# Altium project Velvet_v1.1-2021(revised for PCB).PrjPcb
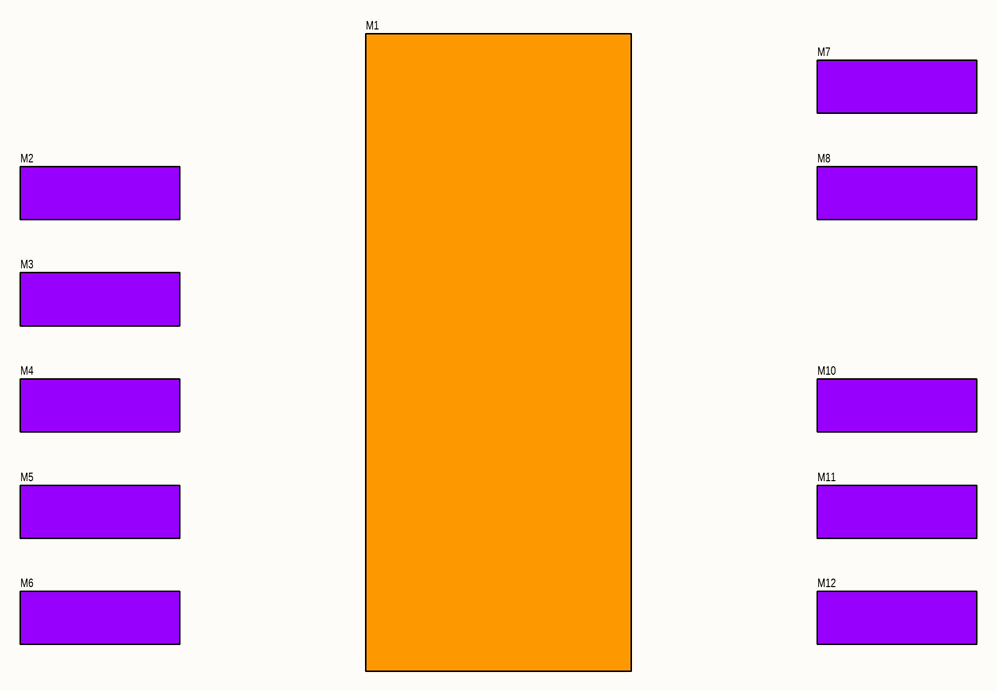
[diagram p0: Схема структурная Velvet_V1.1-2021.SchDoc]
10 sheets, 117 parts. Net scope: flat (ports and power ports of the same name join across sheets).
Sheets:
  Схема структурная Velvet_V1.1-2021.SchDoc
  Схема блока МК.SchDoc
  Схема блока GSM.SchDoc
  Схема блока WiFi.SchDoc
  Схема блока USB-UART.SchDoc
  Схема блока Sensors.SchDoc
  Схема блока IO_Ports.SchDoc
  Схема блока SD.SchDoc
  Схема блока LoRa_RAK3172.SchDoc
  Схема блока MOSFET.SchDoc

## Sheet Схема структурная Velvet_V1.1-2021.SchDoc
size 420 x 297 mm; Address1: Address1; Address2: Address2; Address3: Address3; Address4: Address4; DocumentNumber: АБВГ.123456.001 Э3; SheetNumber: 1; Scale: 1:1; DocumentType: Схема электрическая принципиальная; FirstReferrence: АБВГ.123456.001

### Sub-sheets
M1 = File Name (file not in this document): no entries
M2 = File Name (file not in this document): no entries
M3 = File Name (file not in this document): no entries
M4 = File Name (file not in this document): no entries
M5 = File Name (file not in this document): no entries
M6 = File Name (file not in this document): no entries
M7 = File Name (file not in this document): no entries
M8 = File Name (file not in this document): no entries
M10 = File Name (file not in this document): no entries
M11 = File Name (file not in this document): no entries
M12 = File Name (file not in this document): no entries

### Notes on the sheet
- Перв. примен.
- Справ. №
- Подп. и дата
- Инв. № дубл.
- Взам. инв. №
- Разраб.
- Изм.
- Лист
- № докум.
- Подп.
- Дата
- Лит.
- Масса
- Масштаб
- Пров.
- Т.контр.
- Листов
- Инв. № подл.
- Утв.
- Н.контр.
- 2.106-A3
- Копировал
- Формат А3

## Sheet Схема блока МК.SchDoc
size 420 x 297 mm; Address1: Address1; Address2: Address2; Address3: Address3; Address4: Address4; DocumentNumber: АБВГ.123456.001 Э3; SheetNumber: 1; Scale: 1:1; DocumentType: Схема электрическая принципиальная; FirstReferrence: АБВГ.123456.001
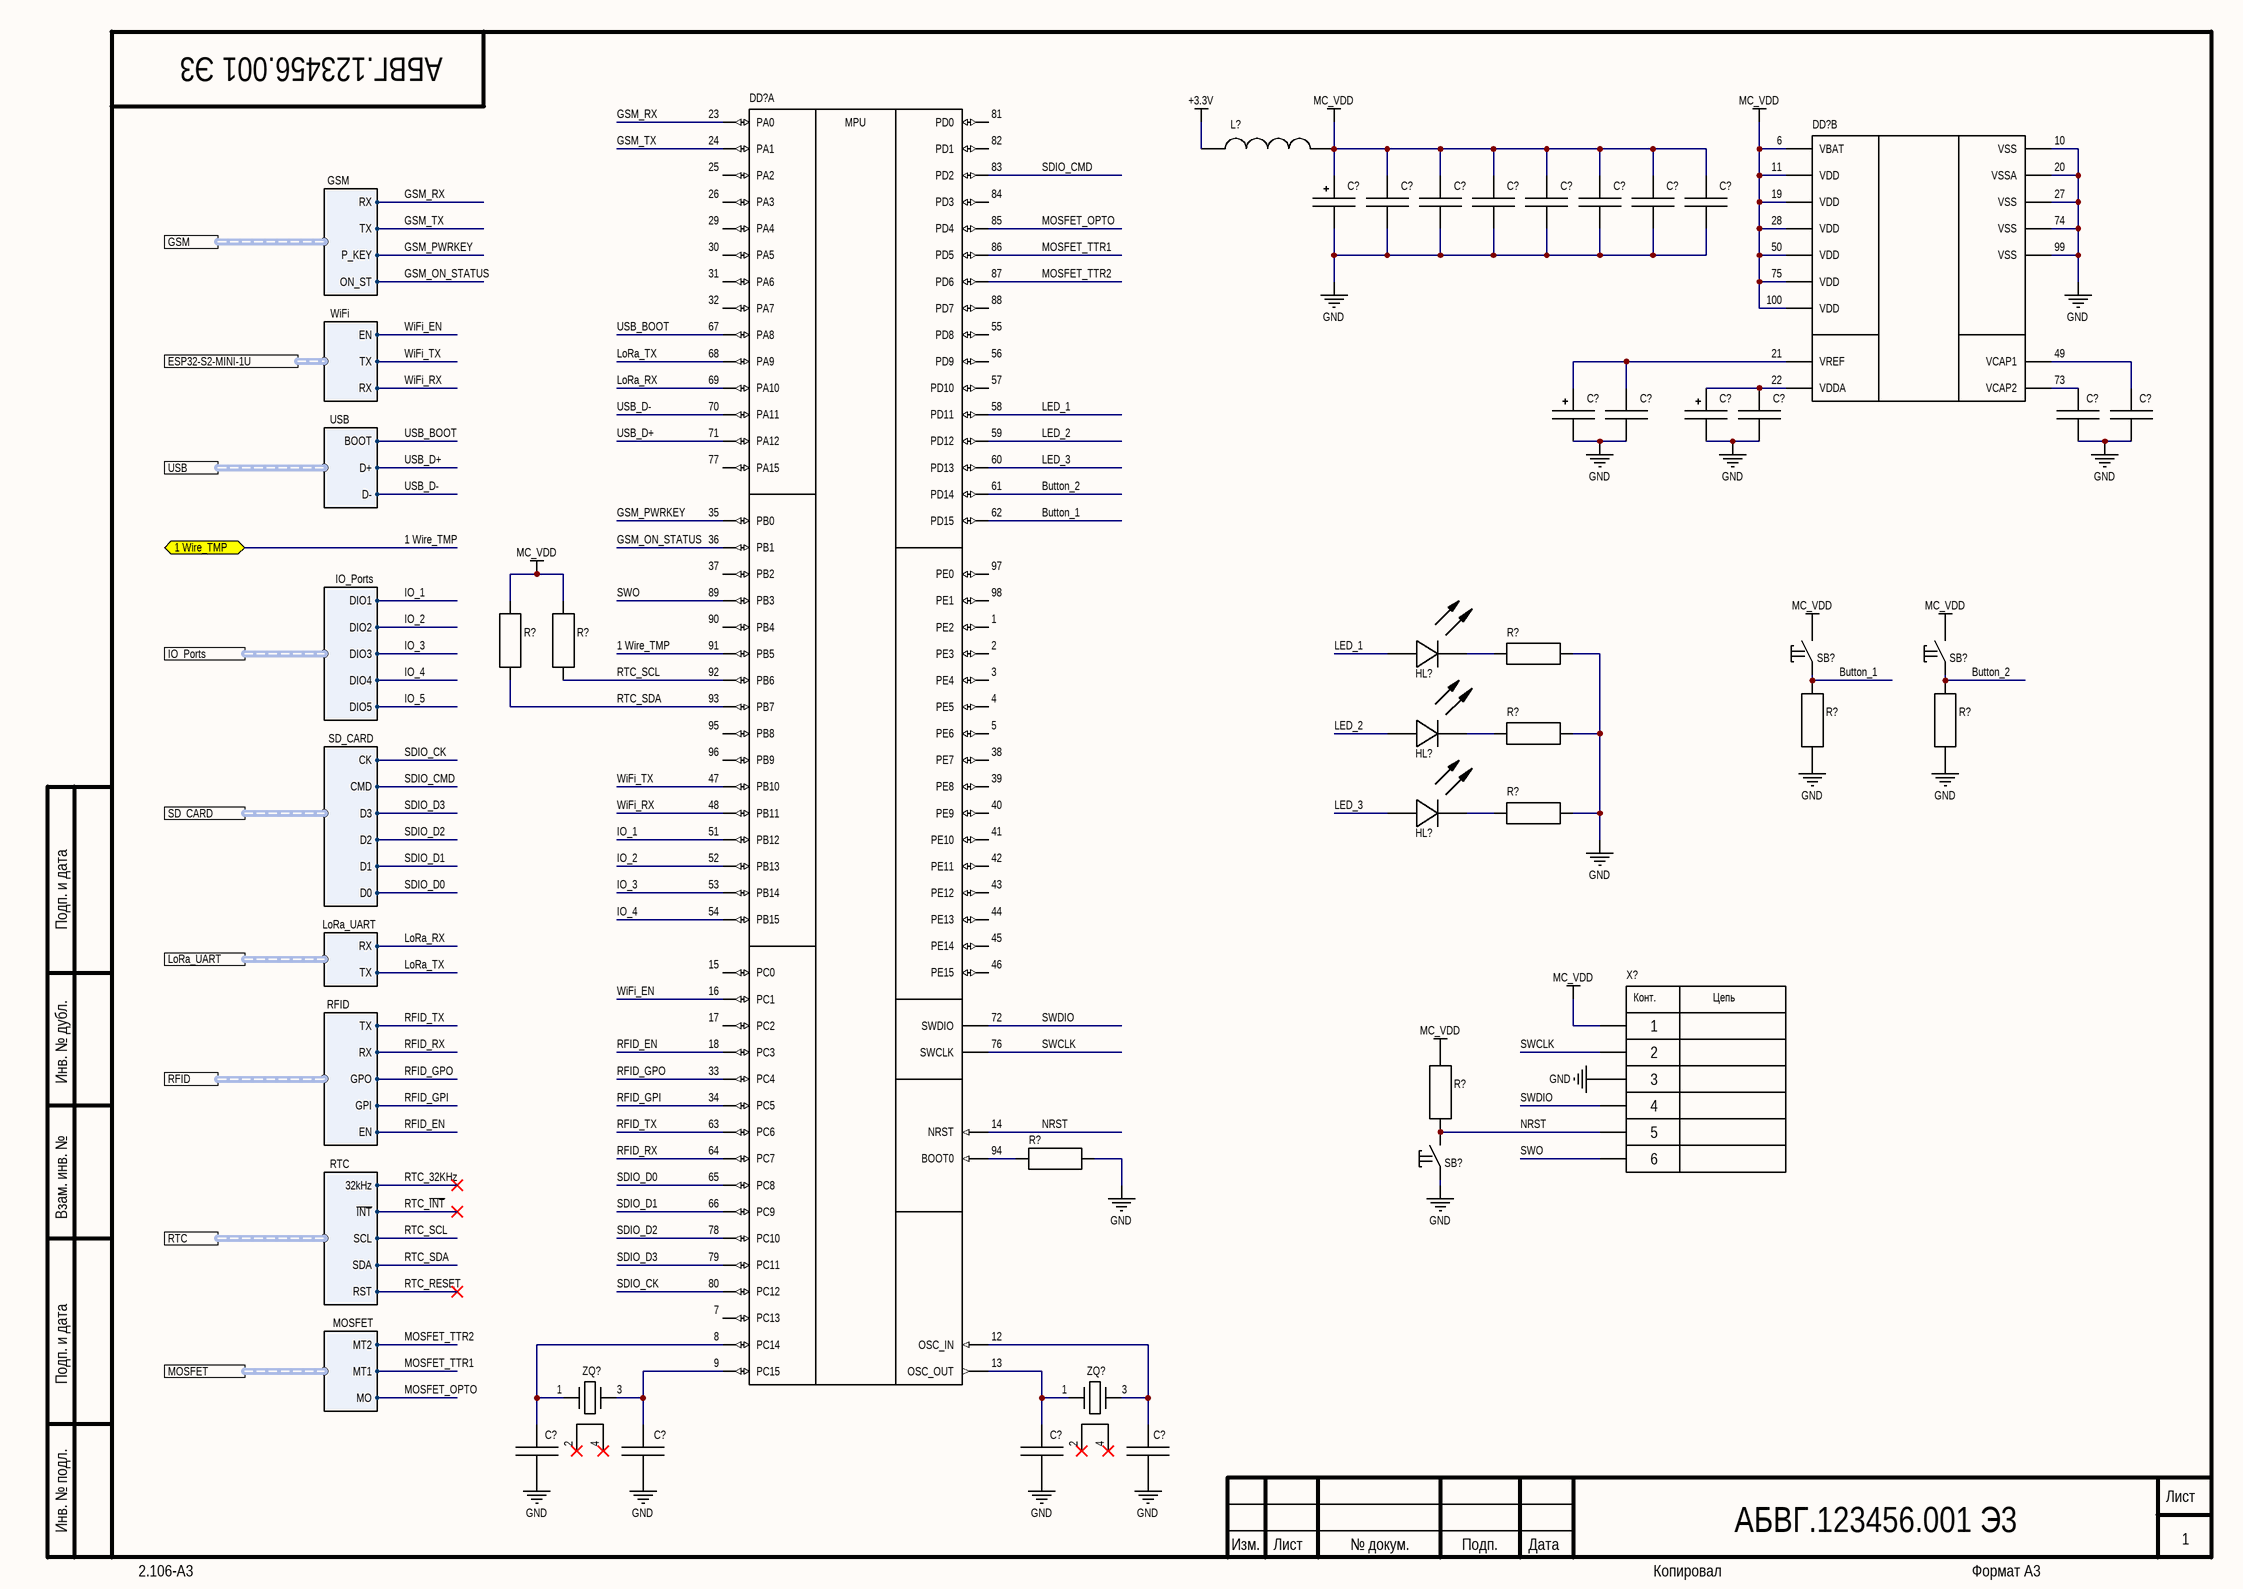
[diagram p1: Схема блока МК.SchDoc]

### Parts
(Parts that share a designator on the sheet are numbered #1, #2 ... from top to bottom, then left to right.)
C?#1  *  [TANTAL_A]  (value not drawn)
C?#2  *  [CH0603C]  (value not drawn)
C?#3  *  [CH0603C]  (value not drawn)
C?#4  *  [CH0603C]  (value not drawn)
C?#5  *  [CH0603C]  (value not drawn)
C?#6  *  [CH0603C]  (value not drawn)
C?#7  *  [CH0603C]  (value not drawn)
C?#8  *  [CH0603C]  (value not drawn)
C?#9  *  [TANTAL_A]  (value not drawn)
C?#10  *  [CH0603C]  (value not drawn)
C?#11  *  [TANTAL_A]  (value not drawn)
C?#12  *  [CH0603C]  (value not drawn)
C?#13  *  [CH0603C]  (value not drawn)
C?#14  *  [CH0603C]  (value not drawn)
C?#15  *  [CH0603C]  (value not drawn)
C?#16  *  [CH0603C]  (value not drawn)
C?#17  *  [CH0603C]  (value not drawn)
C?#18  *  [CH0603C]  (value not drawn)
DD?#1  STM32F407VGT6  [100-LQFP]  (value not drawn)  (part A of 2)
DD?#2  STM32F407VGT6  [100-LQFP]  (value not drawn)  (part B of 2)
HL?#1  *  [CH0805LG]  (value not drawn)
HL?#2  *  [CH0805LG]  (value not drawn)
HL?#3  *  [CH0805LG]  (value not drawn)
L?  *  [CH0603L]  (value not drawn)
R?#1  *  [CH0603R - without silc]  (value not drawn)
R?#2  *  [CH0603R]  (value not drawn)
R?#3  *  [CH0603R]  (value not drawn)
R?#4  *  [CH0603R - without silc]  (value not drawn)
R?#5  *  [CH0603R]  (value not drawn)
R?#6  *  [CH0603R]  (value not drawn)
R?#7  *  [CH0603R - without silc]  (value not drawn)
R?#8  *  [CH0603R]  (value not drawn)
R?#9  *  [CH0603R]  (value not drawn)
SB?#1  Tactile switches  [BUT: 6x6]  (value not drawn)
SB?#2  Tactile switches  [BUT: 6x6]  (value not drawn)
SB?#3  Tactile switches  [BUT: 6x6]  (value not drawn)
X?#1  *  [CON: PLS-6]  (value not drawn)
ZQ?#1  *  [OSC: 3215]  (value not drawn)
ZQ?#2  *  [OSC: ABM3]  (value not drawn)

### Ports
1 Wire_TMP (bidir), ESP32-S2-MINI-1U (harness WiFi), GSM (harness GSM), IO_Ports (harness IO_Ports), LoRa_UART (harness LoRa_UART), MOSFET (harness MOSFET), RFID (harness RFID), RTC (harness RTC), SD_CARD (harness SD_CARD), USB (harness USB)

### Harnesses
GSM: RX, TX, P_KEY, ON_ST
WiFi: EN, TX, RX
USB: BOOT, D+, D-
IO_Ports: DIO1, DIO2, DIO3, DIO4, DIO5
SD_CARD: CK, CMD, D3, D2, D1, D0
LoRa_UART: RX, TX
RFID: TX, RX, GPO, GPI, EN
RTC: 32kHz, ~{INT}, SCL, SDA, RST
MOSFET: MT2, MT1, MO

### Nets
+3.3V: L?.2
GND: C?#1.2 C?#2.2 C?#3.2 C?#4.2 C?#5.2 C?#6.2 C?#7.2 C?#8.2 C?#9.2 C?#10.2 C?#11.2 C?#12.2 C?#13.2 C?#14.2 C?#15.2 C?#16.2 C?#17.2 C?#18.2 DD?#2.10(VSS) DD?#2.20(VSSA) DD?#2.27(VSS) DD?#2.74(VSS) DD?#2.99(VSS) R?#1.2 R?#4.2 R?#5.1 R?#6.1 R?#7.2 R?#9.1 SB?#3.1 X?#1.3
MC_VDD: C?#1.1 C?#2.1 C?#3.1 C?#4.1 C?#5.1 C?#6.1 C?#7.1 C?#8.1 DD?#2.6(VBAT) DD?#2.11(VDD) DD?#2.19(VDD) DD?#2.28(VDD) DD?#2.50(VDD) DD?#2.75(VDD) DD?#2.100(VDD) L?.1 R?#2.2 R?#3.2 R?#8.2 SB?#1.2 SB?#2.2 X?#1.1
1 Wire_TMP: DD?#1.91(PB5) ; port 1 Wire_TMP
Button_1: DD?#1.62(PD15) R?#5.2 SB?#1.1
Button_2: DD?#1.61(PD14) R?#6.2 SB?#2.1
GSM_ON_STATUS: DD?#1.36(PB1) ; port GSM.ON_ST
GSM_PWRKEY: DD?#1.35(PB0) ; port GSM.P_KEY
GSM_RX: DD?#1.23(PA0) ; port GSM.RX
GSM_TX: DD?#1.24(PA1) ; port GSM.TX
IO_1: DD?#1.51(PB12) ; port IO_Ports.DIO1
IO_2: DD?#1.52(PB13) ; port IO_Ports.DIO2
IO_3: DD?#1.53(PB14) ; port IO_Ports.DIO3
IO_4: DD?#1.54(PB15) ; port IO_Ports.DIO4
LED_1: DD?#1.58(PD11) HL?#1.1(A)
LED_2: DD?#1.59(PD12) HL?#2.1(A)
LED_3: DD?#1.60(PD13) HL?#3.1(A)
LoRa_RX: DD?#1.69(PA10) ; port LoRa_UART.RX
LoRa_TX: DD?#1.68(PA9) ; port LoRa_UART.TX
MOSFET_OPTO: DD?#1.85(PD4) ; port MOSFET.MO
MOSFET_TTR1: DD?#1.86(PD5) ; port MOSFET.MT1
MOSFET_TTR2: DD?#1.87(PD6) ; port MOSFET.MT2
NRST: DD?#1.14(NRST) R?#8.1 SB?#3.2 X?#1.5
RFID_EN: DD?#1.18(PC3) ; port RFID.EN
RFID_GPI: DD?#1.34(PC5) ; port RFID.GPI
RFID_GPO: DD?#1.33(PC4) ; port RFID.GPO
RFID_RX: DD?#1.64(PC7) ; port RFID.RX
RFID_TX: DD?#1.63(PC6) ; port RFID.TX
RTC_32KHz: port RTC.32kHz
RTC_~{INT}: port RTC.~{INT}
RTC_RESET: port RTC.RST
RTC_SCL: DD?#1.92(PB6) R?#3.1 ; port RTC.SCL
RTC_SDA: DD?#1.93(PB7) R?#2.1 ; port RTC.SDA
SDIO_CK: DD?#1.80(PC12) ; port SD_CARD.CK
SDIO_CMD: DD?#1.83(PD2) ; port SD_CARD.CMD
SDIO_D0: DD?#1.65(PC8) ; port SD_CARD.D0
SDIO_D1: DD?#1.66(PC9) ; port SD_CARD.D1
SDIO_D2: DD?#1.78(PC10) ; port SD_CARD.D2
SDIO_D3: DD?#1.79(PC11) ; port SD_CARD.D3
SWCLK: DD?#1.76(SWCLK) X?#1.2
SWDIO: DD?#1.72(SWDIO) X?#1.4
SWO: DD?#1.89(PB3) X?#1.6
USB_BOOT: DD?#1.67(PA8) ; port USB.BOOT
USB_D+: DD?#1.71(PA12) ; port USB.D+
USB_D-: DD?#1.70(PA11) ; port USB.D-
WiFi_EN: DD?#1.16(PC1) ; port ESP32-S2-MINI-1U.EN
WiFi_RX: DD?#1.48(PB11) ; port ESP32-S2-MINI-1U.RX
WiFi_TX: DD?#1.47(PB10) ; port ESP32-S2-MINI-1U.TX
NetC?#9_1: C?#9.1 C?#10.1 DD?#2.21(VREF)
NetC?#11_1: C?#11.1 C?#12.1 DD?#2.22(VDDA)
NetC?#13_1: C?#13.1 DD?#2.73(VCAP2)
NetC?#14_1: C?#14.1 DD?#2.49(VCAP1)
NetC?#15_1: C?#15.1 DD?#1.8(PC14) ZQ?#1.1
NetC?#16_1: C?#16.1 DD?#1.9(PC15) ZQ?#1.3
NetC?#17_1: C?#17.1 DD?#1.13(OSC_OUT) ZQ?#2.1
NetC?#18_1: C?#18.1 DD?#1.12(OSC_IN) ZQ?#2.3
NetDD?#1_94: DD?#1.94(BOOT0) R?#9.2
NetHL?#1_2: HL?#1.2(C) R?#1.1
NetHL?#2_2: HL?#2.2(C) R?#4.1
NetHL?#3_2: HL?#3.2(C) R?#7.1

Not connected (* = marked no-connect by the designer): DD?#1 1(PE2) 2(PE3) 3(PE4) 4(PE5) 5(PE6) 7(PC13) 15(PC0) 17(PC2) 25(PA2) 26(PA3) 29(PA4) 30(PA5) 31(PA6) 32(PA7) 37(PB2) 38(PE7) 39(PE8) 40(PE9) 41(PE10) 42(PE11) 43(PE12) 44(PE13) 45(PE14) 46(PE15) 55(PD8) 56(PD9) 57(PD10) 77(PA15) 81(PD0) 82(PD1) 84(PD3) 88(PD7) 90(PB4) 95(PB8) 96(PB9) 97(PE0) 98(PE1); ZQ?#1 2* 4*; ZQ?#2 2* 4*

### Notes on the sheet
- Подп. и дата
- Инв. № дубл.
- Взам. инв. №
- Инв. № подл.
- Изм.
- Лист
- № докум.
- Подп.
- Дата
- 2.106-A3
- Копировал
- Формат А3
- (in symbol 6-Connector) Конт.; Цепь
- (in symbol STM32F407VGT6, part A) MPU

### Library data of the parts
C?#1 C?#9 C?#11 = TantalCap: Manufacturer: *; Model: *; HelpURL: *; ComponentKind: *; Value: *
C?#2-C?#8 C?#10 C?#12-C?#18 = Capacitor: Manufacturer: *; Model: *; HelpURL: *; ComponentKind: *; Value: *
DD?#1 = STM32F407VGT6: Cortex-M4; Manufacturer: STMicroelectronics; Model: STM32F407VGT6; HelpURL: https://www.digikey.com/en/products/detail/stmicroelectronics/STM32F407VGT6/2747117; ComponentKind: 100-LQFP; Supplier 1: Digi-Key; Supplier Part Number 1: 497-11605-ND
DD?#2 = STM32F407VGT6: Cortex-M4; Manufacturer: STMicroelectronics; Model: STM32F407VET6; HelpURL: https://www.digikey.com/product-detail/en/stmicroelectronics/STM32F407VET6/497-12075-ND/2793093; ComponentKind: 100-LQFP
HL?#1-HL?#3 = LED: Manufacturer: *; Model: *; HelpURL: *; ComponentKind: *; Value: *
L? = Inductor: Manufacturer: *; Model: *; HelpURL: https://www.digikey.com/en/products/detail/murata-electronics/BLM18AG102SN1D/584226?s=N4IgTCBcDaIEIBkCyBGAHAQQOIoAxgGUA5FAERAF0BfIA; ComponentKind: *; Value: *; Supplier 1: RSComponents; Supplier Part Number 1: 2303783
R?#1-R?#9 = Resistor: Manufacturer: *; Model: *; HelpURL: *; ComponentKind: *; Value: *
SB?#1-SB?#3 = Tactile switches: 6x6 mm; Manufacturer: *; Model: *; HelpURL: *; ComponentKind: *
X?#1 = 6-Connector: Model: *; Manufacturer: *; HelpURL: *; ComponentKind: *
ZQ?#1 ZQ?#2 = Oscillator: Manufacturer: *; Model: *; HelpURL: *; ComponentKind: *; Value: *

## Sheet Схема блока GSM.SchDoc
size 420 x 297 mm; Address1: Address1; Address2: Address2; Address3: Address3; Address4: Address4; DocumentNumber: АБВГ.123456.001 Э3; SheetNumber: 1; Scale: 1:1; DocumentType: Схема электрическая принципиальная; FirstReferrence: АБВГ.123456.001
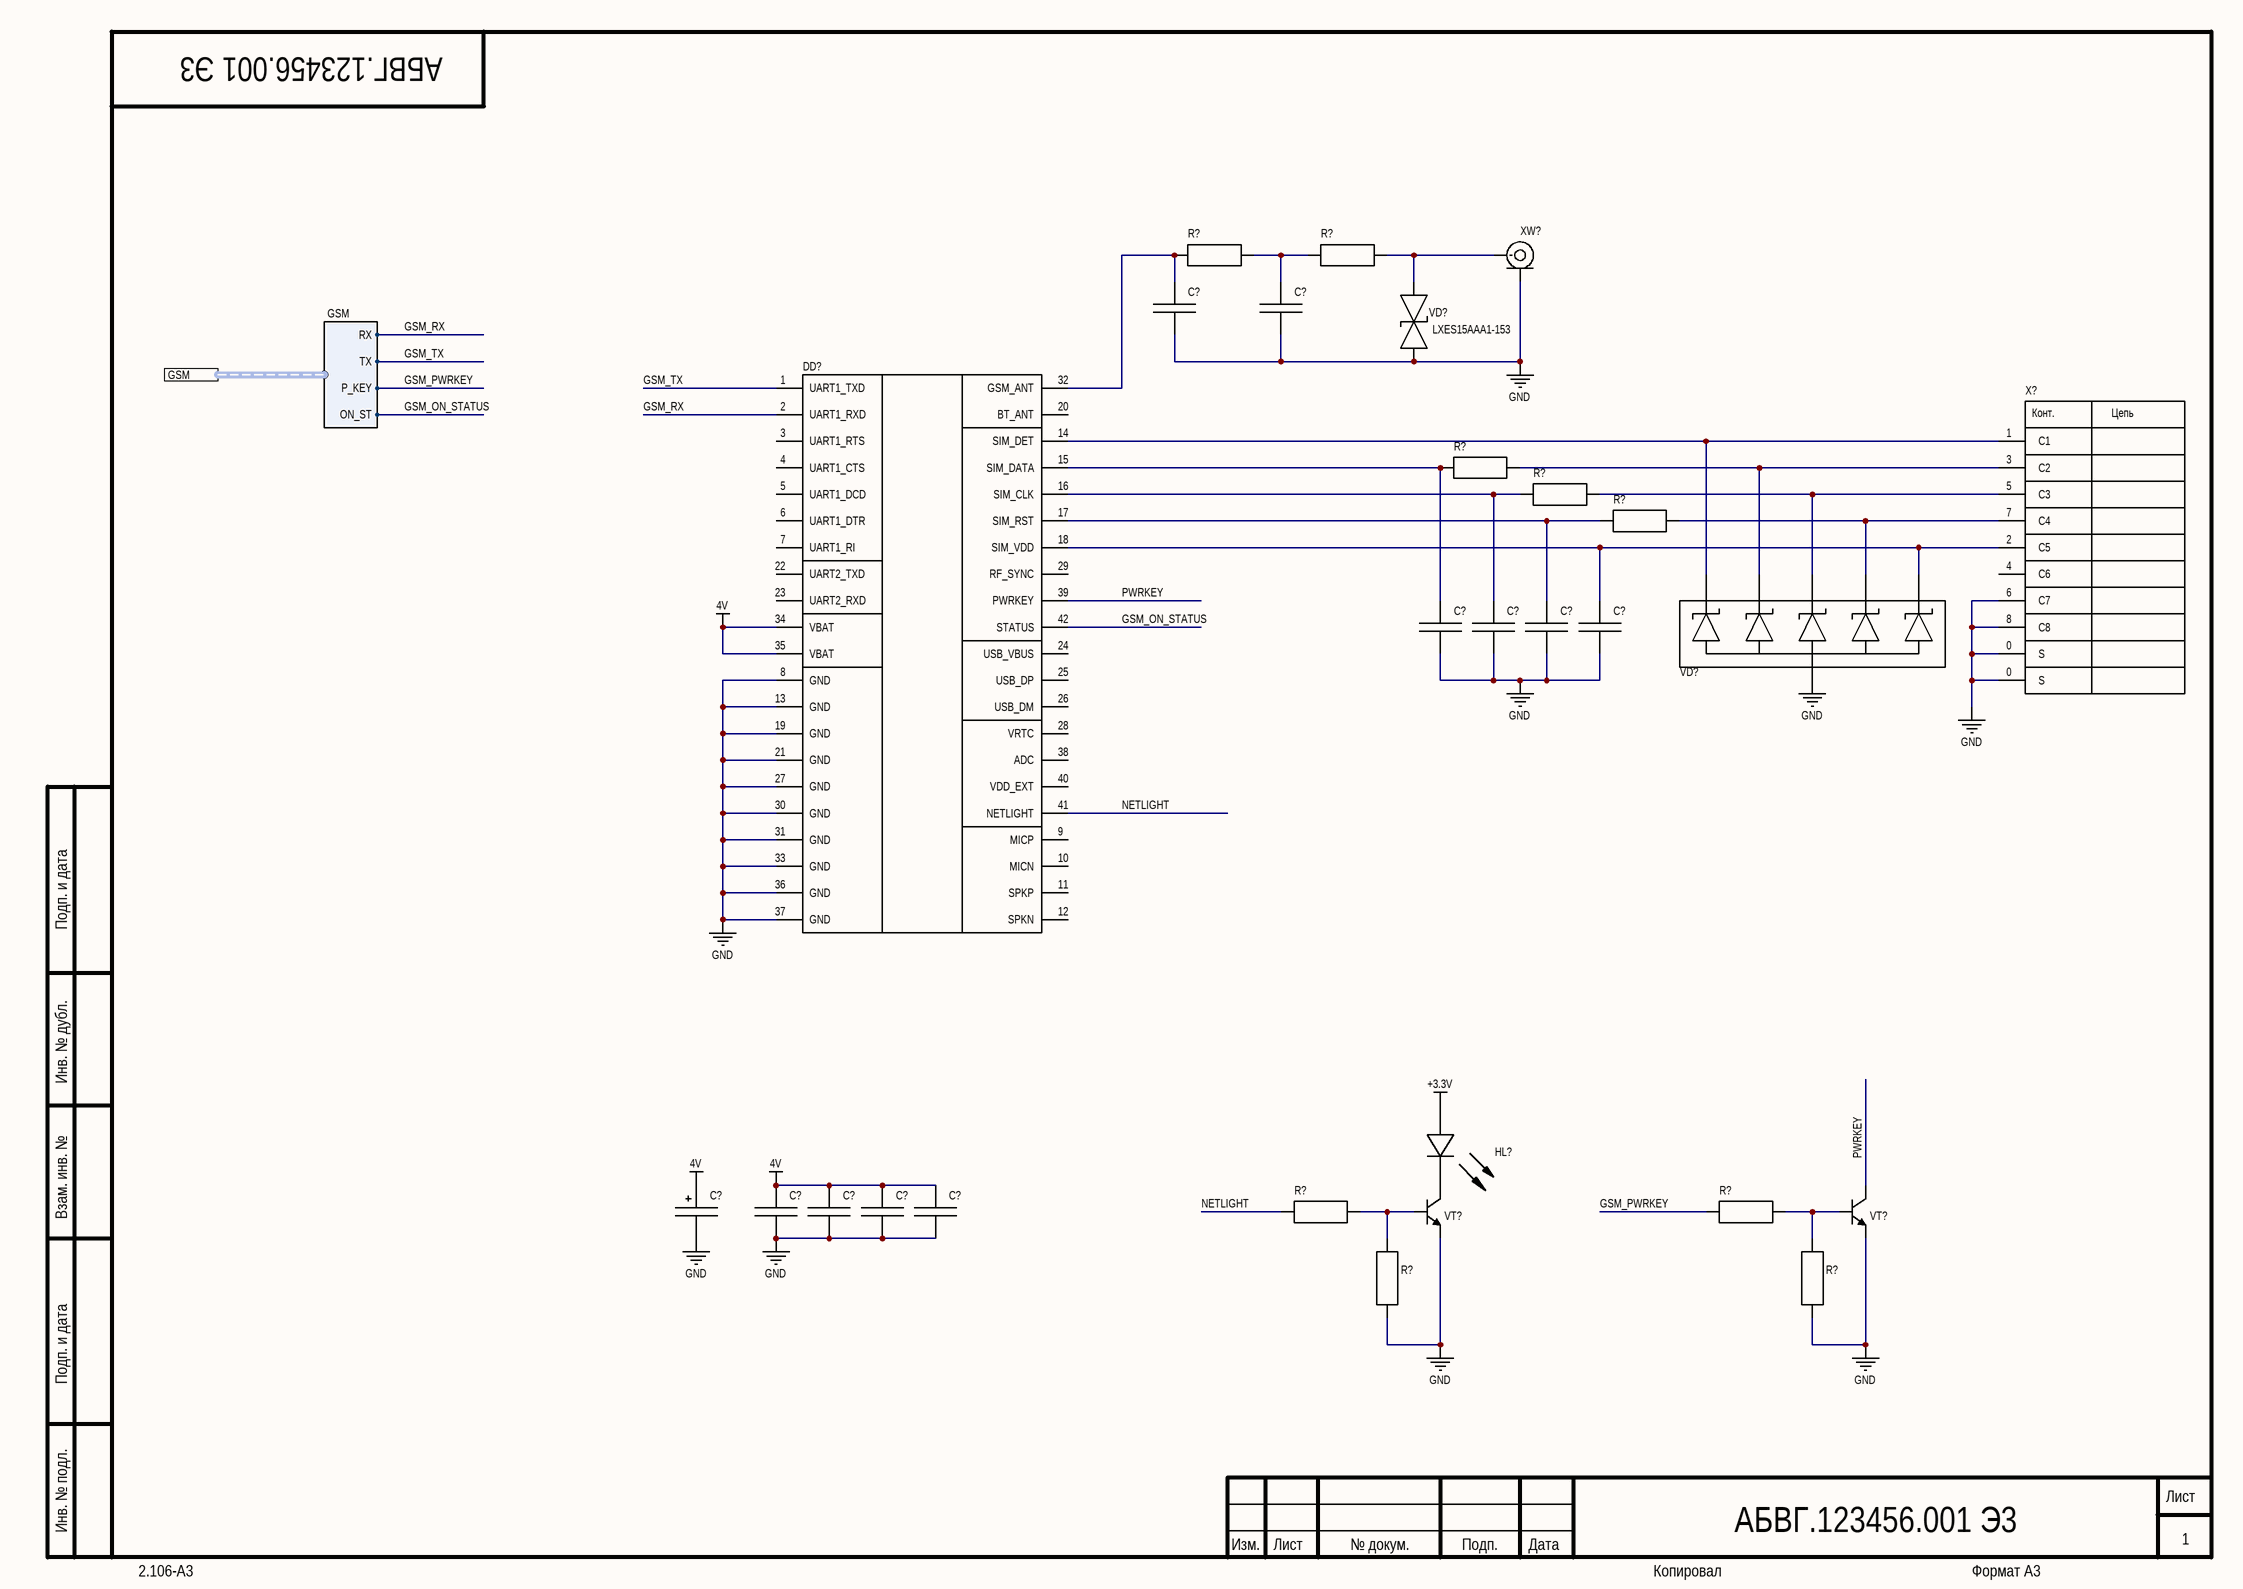
[diagram p2: Схема блока GSM.SchDoc]

### Parts
(Parts that share a designator on the sheet are numbered #1, #2 ... from top to bottom, then left to right.)
C?#19  *  [CH0603C]  (value not drawn)
C?#20  *  [CH0603C]  (value not drawn)
C?#21  *  [CH0603C]  (value not drawn)
C?#22  *  [CH0603C]  (value not drawn)
C?#23  *  [CH0603C]  (value not drawn)
C?#24  *  [CH0603C]  (value not drawn)
C?#25  *  [TANTAL_A]  (value not drawn)
C?#26  *  [CH0603C]  (value not drawn)
C?#27  *  [CH0603C]  (value not drawn)
C?#28  *  [CH0603C]  (value not drawn)
C?#29  *  [CH0603C]  (value not drawn)
DD?#3  SIM800С  [MOD: SIM800C]  (value not drawn)
HL?#4  2.1V GREEN  [CH0805LG]  (value not drawn)
R?#10  *  [CH0603R - without silc]  (value not drawn)
R?#11  *  [CH0603R - without silc]  (value not drawn)
R?#12  *  [CH0603R - without silc]  (value not drawn)
R?#13  *  [CH0603R - without silc]  (value not drawn)
R?#14  *  [CH0603R - without silc]  (value not drawn)
R?#15  *  [CH0603R - without silc]  (value not drawn)
R?#16  *  [CH0603R - without silc]  (value not drawn)
R?#17  *  [CH0603R - without silc]  (value not drawn)
R?#18  *  [CH0603R - without silc]  (value not drawn)
VD?#1  LXES15AAA1-153  [CH0402L]
VD?#2  SMF05CT1G  [SOT-363]  (value not drawn)
VT?#1  *  [8-HSOF]  (value not drawn)
VT?#2  *  [8-HSOF]  (value not drawn)
X?#2  *  [CON: MicroSIM 8P SMD]  (value not drawn)
XW?  SMA  [CON: SMA]  (value not drawn)

### Ports
GSM (harness GSM)

### Harnesses
GSM: RX, TX, P_KEY, ON_ST

### Nets
4V: C?#25.1 C?#26.1 C?#27.1 C?#28.1 C?#29.1 DD?#3.34(VBAT) DD?#3.35(VBAT)
+3.3V: HL?#4.1(A)
GND: C?#19.2 C?#20.2 C?#21.2 C?#22.2 C?#23.2 C?#24.2 C?#25.2 C?#26.2 C?#27.2 C?#28.2 C?#29.2 DD?#3.8(GND) DD?#3.13(GND) DD?#3.19(GND) DD?#3.21(GND) DD?#3.27(GND) DD?#3.30(GND) DD?#3.31(GND) DD?#3.33(GND) DD?#3.36(GND) DD?#3.37(GND) R?#17.1 R?#18.1 VD?#1.1(A) VD?#2.2 VT?#1.3(E) VT?#2.3(E) X?#2.0(S) X?#2.6(C7) X?#2.8(C8) XW?.2(IN)
GSM_ON_STATUS: DD?#3.42(STATUS) ; port GSM.ON_ST
GSM_PWRKEY: R?#16.1 ; port GSM.P_KEY
GSM_RX: DD?#3.2(UART1_RXD) ; port GSM.RX
GSM_TX: DD?#3.1(UART1_TXD) ; port GSM.TX
NETLIGHT: DD?#3.41(NETLIGHT) R?#15.1
PWRKEY: DD?#3.39(PWRKEY) VT?#2.2(C)
NetC?#19_1: C?#19.1 DD?#3.32(GSM_ANT) R?#10.1
NetC?#20_1: C?#20.1 R?#10.2 R?#11.1
NetC?#21_1: C?#21.1 DD?#3.15(SIM_DATA) R?#12.1
NetC?#22_1: C?#22.1 DD?#3.16(SIM_CLK) R?#13.1
NetC?#23_1: C?#23.1 DD?#3.17(SIM_RST) R?#14.1
NetC?#24_1: C?#24.1 DD?#3.18(SIM_VDD) VD?#2.6 X?#2.2(C5)
NetDD?#3_14: DD?#3.14(SIM_DET) VD?#2.1 X?#2.1(C1)
NetHL?#4_2: HL?#4.2(C) VT?#1.2(C)
NetR?#11_2: R?#11.2 VD?#1.2(C) XW?.1(IN)
NetR?#12_2: R?#12.2 VD?#2.3 X?#2.3(C2)
NetR?#13_2: R?#13.2 VD?#2.4 X?#2.5(C3)
NetR?#14_2: R?#14.2 VD?#2.5 X?#2.7(C4)
NetR?#15_2: R?#15.2 R?#17.2 VT?#1.1(B)
NetR?#16_2: R?#16.2 R?#18.2 VT?#2.1(B)

Not connected (* = marked no-connect by the designer): DD?#3 3(UART1_RTS) 4(UART1_CTS) 5(UART1_DCD) 6(UART1_DTR) 7(UART1_RI) 9(MICP) 10(MICN) 11(SPKP) 12(SPKN) 20(BT_ANT) 22(UART2_TXD) 23(UART2_RXD) 24(USB_VBUS) 25(USB_DP) 26(USB_DM) 28(VRTC) 29(RF_SYNC) 38(ADC) 40(VDD_EXT); X?#2 4(C6)

### Notes on the sheet
- Подп. и дата
- Инв. № дубл.
- Взам. инв. №
- Инв. № подл.
- Изм.
- Лист
- № докум.
- Подп.
- Дата
- 2.106-A3
- Копировал
- Формат А3
- (in symbol 10-Connector) Конт.; Цепь

### Library data of the parts
C?#19-C?#24 C?#26-C?#29 = Capacitor: Manufacturer: *; Model: *; HelpURL: *; ComponentKind: *; Value: *
C?#25 = TantalCap: Manufacturer: *; Model: *; HelpURL: *; ComponentKind: *; Value: *
DD?#3 = SIM800С: GSM; Manufacturer: SIMCom Wireless Solutions; Model: SIM800C; ComponentKind: SMD; HelpURL: http://mt-system.ru/SIMCom/SIM800C
HL?#4 = LED: Manufacturer: Lite-On Inc.; Model: LTST-S220GKT; HelpURL: https://www.digikey.com/en/products/detail/LTST-S220GKT/160-1218-1-ND/337134?utm_campaign=buynow&utm_medium=aggregator&curr=usd&utm_source=octopart; ComponentKind: 0805 (2012 Metric); Value: 2.1V GREEN
R?#10-R?#18 = Resistor: Manufacturer: *; Model: *; HelpURL: *; ComponentKind: *; Value: *
VD?#1 = Diod TVS: Manufacturer: Murata Electronics; ComponentKind: Surface Mount 1005; Model: LXES15AAA1-153; HelpURL: https://www.digikey.com/en/products/detail/murata-electronics/LXES15AAA1-153/5843762?s=N4IgTCBcDaIDIA0CiBlAjAVgII7QWkwGYQBdAXyA
VD?#2 = Diod Schottky Array: Manufacturer: onsemi; ComponentKind: 12.5V Clamp 8A (8/20µs) Ipp Tvs Diode Surface Mount SC-88/SC70-6/SOT-363; Model: SMF05CT1G; HelpURL: https://www.digikey.com/en/products/detail/onsemi/SMF05CT1G/921631?s=N4IgTCBcDaIMoFkBiAGArAYQCoEYDiIAugL5A
VT?#1 VT?#2 = Transistor NPN: Bipolar; Model: *; Manufacturer: *; ComponentKind: *; HelpURL: *
X?#2 = 10-Connector: MicroSIM; Model: *; Manufacturer: *; HelpURL: *; ComponentKind: *
XW? = SMA: RF; Model: *; Manufacturer: *; HelpURL: *; ComponentKind: *

## Sheet Схема блока WiFi.SchDoc
size 420 x 297 mm; Address1: Address1; Address2: Address2; Address3: Address3; Address4: Address4; DocumentNumber: АБВГ.123456.001 Э3; SheetNumber: 1; Scale: 1:1; DocumentType: Схема электрическая принципиальная; FirstReferrence: АБВГ.123456.001
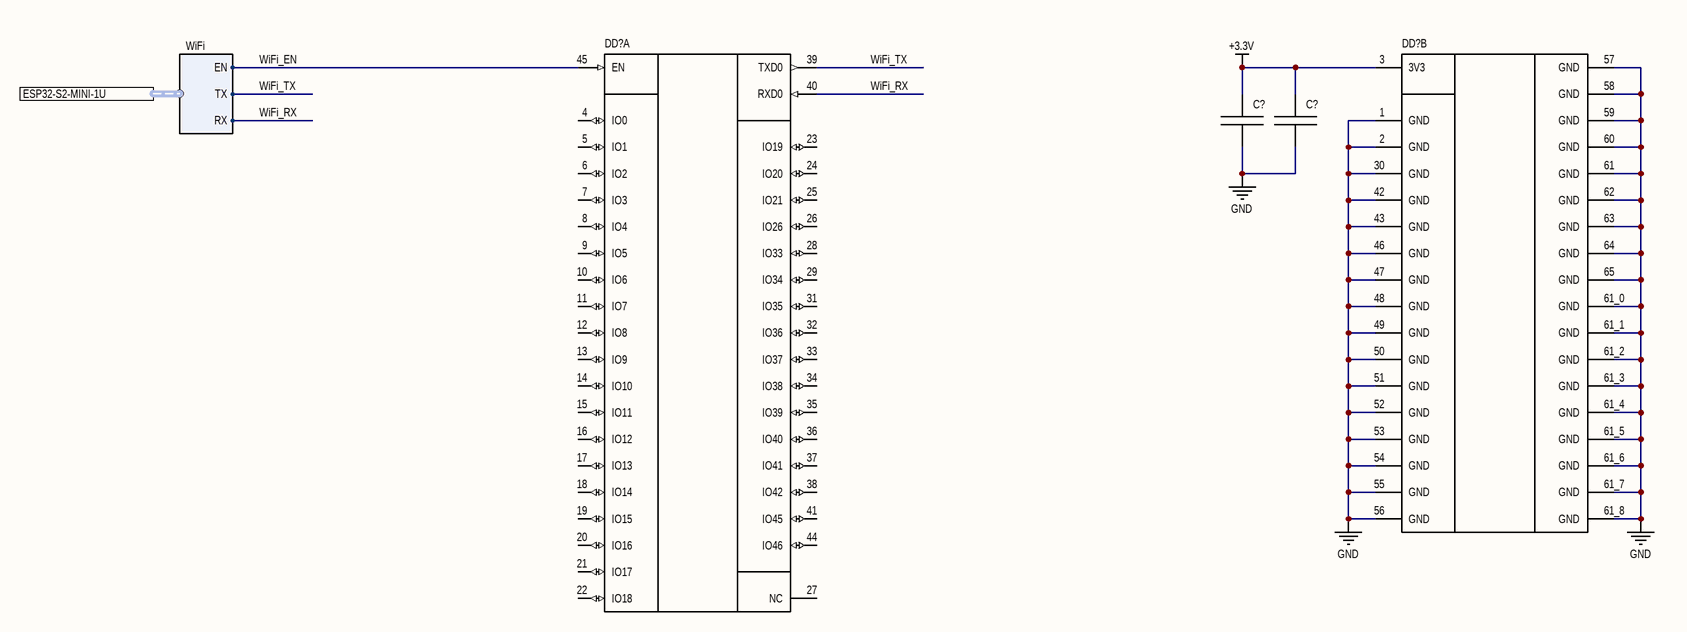
[diagram p3: Схема блока WiFi.SchDoc]

### Parts
(Parts that share a designator on the sheet are numbered #1, #2 ... from top to bottom, then left to right.)
C?#30  *  [CH0805C]  (value not drawn)
C?#31  *  [CH0805C]  (value not drawn)
DD?#4  ESP32­S2­MINI­1U  [MOD: ESP32-S2-MINI-1U]  (value not drawn)  (part A of 2)
DD?#5  ESP32­S2­MINI­1U  [MOD: ESP32-S2-MINI-1U]  (value not drawn)  (part B of 2)

### Ports
ESP32-S2-MINI-1U (harness WiFi)

### Harnesses
WiFi: EN, TX, RX

### Nets
+3.3V: C?#30.1 C?#31.1 DD?#5.3(3V3)
GND: C?#30.2 C?#31.2 DD?#5.1(GND) DD?#5.2(GND) DD?#5.30(GND) DD?#5.42(GND) DD?#5.43(GND) DD?#5.46(GND) DD?#5.47(GND) DD?#5.48(GND) DD?#5.49(GND) DD?#5.50(GND) DD?#5.51(GND) DD?#5.52(GND) DD?#5.53(GND) DD?#5.54(GND) DD?#5.55(GND) DD?#5.56(GND) DD?#5.57(GND) DD?#5.58(GND) DD?#5.59(GND) DD?#5.60(GND) DD?#5.61(GND) DD?#5.61_0(GND) DD?#5.61_1(GND) DD?#5.61_2(GND) DD?#5.61_3(GND) DD?#5.61_4(GND) DD?#5.61_5(GND) DD?#5.61_6(GND) DD?#5.61_7(GND) DD?#5.61_8(GND) DD?#5.62(GND) DD?#5.63(GND) DD?#5.64(GND) DD?#5.65(GND)
WiFi_EN: DD?#4.45(EN) ; port ESP32-S2-MINI-1U.EN
WiFi_RX: DD?#4.40(RXD0) ; port ESP32-S2-MINI-1U.RX
WiFi_TX: DD?#4.39(TXD0) ; port ESP32-S2-MINI-1U.TX

Not connected (* = marked no-connect by the designer): DD?#4 4(IO0) 5(IO1) 6(IO2) 7(IO3) 8(IO4) 9(IO5) 10(IO6) 11(IO7) 12(IO8) 13(IO9) 14(IO10) 15(IO11) 16(IO12) 17(IO13) 18(IO14) 19(IO15) 20(IO16) 21(IO17) 22(IO18) 23(IO19) 24(IO20) 25(IO21) 26(IO26) 27(NC) 28(IO33) 29(IO34) 31(IO35) 32(IO36) 33(IO37) 34(IO38) 35(IO39) 36(IO40) 37(IO41) 38(IO42) 41(IO45) 44(IO46)

### Notes on the sheet
- Подп. и дата
- Инв. № дубл.
- Взам. инв. №
- Инв. № подл.
- Изм.
- Лист
- № докум.
- Подп.
- Дата
- 2.106-A3
- Копировал
- Формат А3

### Library data of the parts
C?#30 C?#31 = Capacitor: Manufacturer: *; Model: *; HelpURL: *; ComponentKind: *; Value: *
DD?#4 DD?#5 = ESP32­S2­MINI­1U: WiFi Module; Manufacturer: Espressif Systems; Model: ESP32-S2-MINI-1U-N4R2; ComponentKind: SMD; HelpURL: https://www.digikey.com/en/products/detail/espressif-systems/ESP32-S2-MINI-1U-N4R2/15222567

## Sheet Схема блока USB-UART.SchDoc
size 420 x 297 mm; Address1: Address1; Address2: Address2; Address3: Address3; Address4: Address4; DocumentNumber: АБВГ.123456.001 Э3; SheetNumber: 1; Scale: 1:1; DocumentType: Схема электрическая принципиальная; FirstReferrence: АБВГ.123456.001
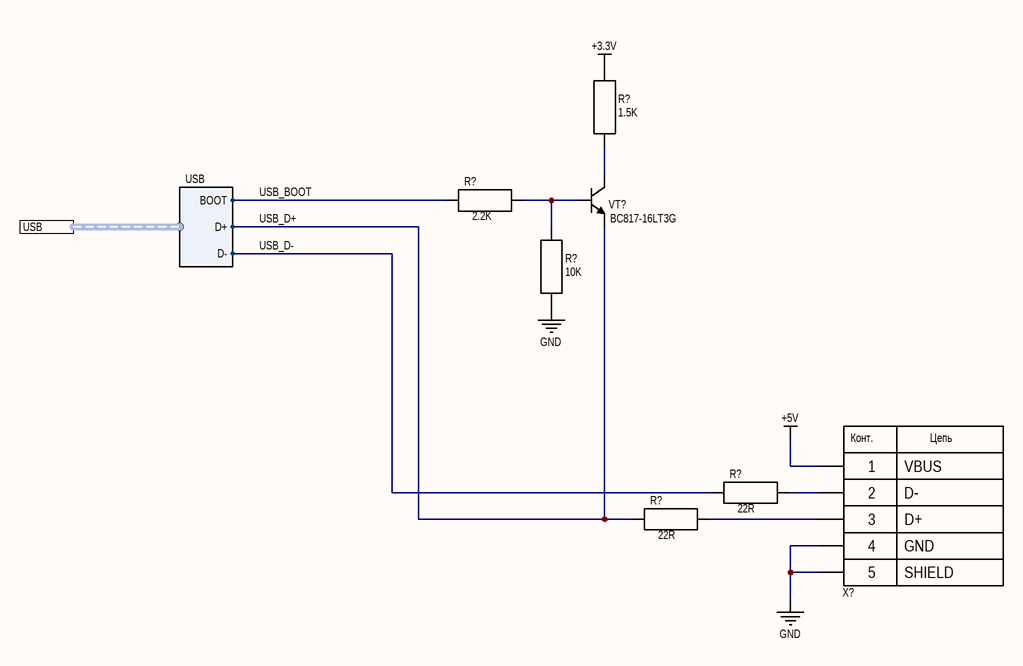
[diagram p4: Схема блока USB-UART.SchDoc]

### Parts
(Parts that share a designator on the sheet are numbered #1, #2 ... from top to bottom, then left to right.)
R?#19  1.5K  [CH0603R]
R?#20  2.2K  [CH0603R]
R?#21  10K  [CH0603R]
R?#22  22R  [CH0603R]
R?#23  22R  [CH0603R]
VT?#3  BC817-16LT3G  [SOT23_123]
X?#3  "USB"  [CON: USB-A]  (value not drawn)

### Ports
USB (harness USB)

### Harnesses
USB: BOOT, D+, D-

### Nets
+3.3V: R?#19.2
+5V: X?#3.1(1________VBUS)
GND: R?#21.1 X?#3.4(4________GND) X?#3.5(5________SHIELD)
USB_BOOT: R?#20.1 ; port USB.BOOT
USB_D+: R?#23.1 VT?#3.3(E) ; port USB.D+
USB_D-: R?#22.1 ; port USB.D-
NetR?#19_1: R?#19.1 VT?#3.2(C)
NetR?#20_2: R?#20.2 R?#21.2 VT?#3.1(B)
NetR?#22_2: R?#22.2 X?#3.2(2________D-)
NetR?#23_2: R?#23.2 X?#3.3(3________D+)

### Notes on the sheet
- Подп. и дата
- Инв. № дубл.
- Взам. инв. №
- Инв. № подл.
- Изм.
- Лист
- № докум.
- Подп.
- Дата
- 2.106-A3
- Копировал
- Формат А3
- (in symbol USB-A) Конт.; Цепь

### Library data of the parts
R?#19 = Resistor: Manufacturer: Panasonic Electronic Components; Model: ERJ-3EKF1501V; HelpURL: https://www.digikey.com/en/products/detail/panasonic-electronic-components/ERJ-3EKF1501V/196052?s=N4IgTCBcDaIKICUBSBaAzHA0gMQIwFYAGXANRAF0BfIA; ComponentKind: 0603 (1608 Metric); Value: 1.5K
R?#20 = Resistor: Manufacturer: Panasonic Electronic Components; Model: ERJ-3GEYJ222V; HelpURL: https://www.digikey.com/en/products/detail/panasonic-electronic-components/ERJ-3GEYJ222V/135862?s=N4IgTCBcDaIKICUBSBaAzAcTgTSWfAaiALoC%2BQA; ComponentKind: 0603 (1608 Metric); Value: 2.2K
R?#21 = Resistor: Manufacturer: Panasonic Electronic Components; Model: ERJ-3GEYJ103V; HelpURL: https://www.digikey.com/en/products/detail/panasonic-electronic-components/ERJ-3GEYJ103V/135662?s=N4IgTCBcDaIKICUBSBaAzAcTgTSQRgAY0A1EAXQF8g; ComponentKind: 0603 (1608 Metric); Value: 10K
R?#22 R?#23 = Resistor: Manufacturer: Panasonic Electronic Components; Model: ERJ-3GEYJ220V; HelpURL: https://www.digikey.com/en/products/detail/panasonic-electronic-components/ERJ-3GEYJ220V/135600?s=N4IgTCBcDaIKICUBSBaAzAcTgTSWMADAGogC6AvkA; ComponentKind: 0603 (1608 Metric); Value: 22R
VT?#3 = Transistor NPN: Bipolar; Manufacturer: onsemi; Model: BC817-16LT3G; ComponentKind: SOT-23-3 (TO-236); HelpURL: https://www.digikey.com/en/products/detail/onsemi/bc817-16lt3g/1475941
X?#3 = USB-A: USB; Manufacturer: TE Connectivity; Model: 292303-2; HelpURL: https://www.digikey.com/product-detail/en/te-connectivity-amp-connectors/292303-2/A105221-ND/953990; ComponentKind: type A

## Sheet Схема блока Sensors.SchDoc
size 420 x 297 mm; Address1: Address1; Address2: Address2; Address3: Address3; Address4: Address4; DocumentNumber: АБВГ.123456.001 Э3; SheetNumber: 1; Scale: 1:1; DocumentType: Схема электрическая принципиальная; FirstReferrence: АБВГ.123456.001
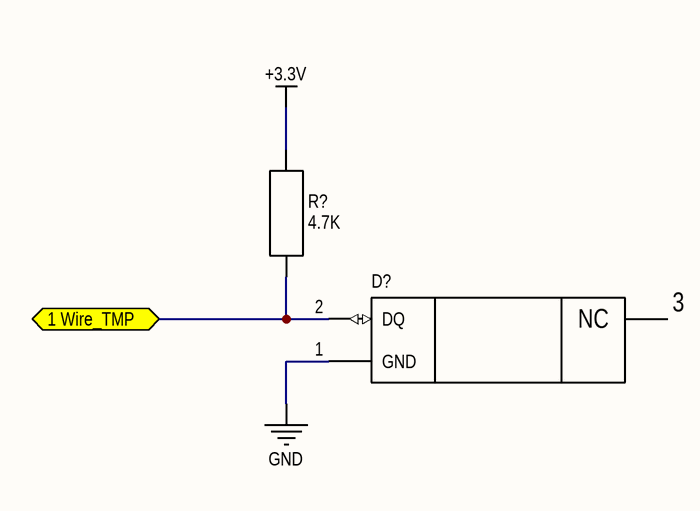
[diagram p5: Схема блока Sensors.SchDoc]

### Parts
(Parts that share a designator on the sheet are numbered #1, #2 ... from top to bottom, then left to right.)
D?  MAX31820PAR  [TO-92-3]  (value not drawn)
R?#24  4.7K  [CH0603R]

### Ports
1 Wire_TMP (bidir)

### Nets
+3.3V: R?#24.2
GND: D?.1(GND)
1 Wire_TMP: D?.2(DQ) R?#24.1 ; port 1 Wire_TMP

Not connected (* = marked no-connect by the designer): D? 3(NC)

### Notes on the sheet
- Подп. и дата
- Инв. № дубл.
- Взам. инв. №
- Инв. № подл.
- Изм.
- Лист
- № докум.
- Подп.
- Дата
- 2.106-A3
- Копировал
- Формат А3

### Library data of the parts
D? = MAX31820PAR: Temp sensor 1Wire; Manufacturer: Analog Devices; Model: AD22105ARZ; ComponentKind: 8-SOIC; HelpURL: https://www.digikey.com/product-detail/en/analog-devices-inc/AD22105ARZ/AD22105ARZ-ND/617049
R?#24 = Resistor: ComponentKind: 0603 (1608 Metric); Value: 4.7K

## Sheet Схема блока IO_Ports.SchDoc
size 420 x 297 mm; Address1: Address1; Address2: Address2; Address3: Address3; Address4: Address4; DocumentNumber: АБВГ.123456.001 Э3; SheetNumber: 1; Scale: 1:1; DocumentType: Схема электрическая принципиальная; FirstReferrence: АБВГ.123456.001
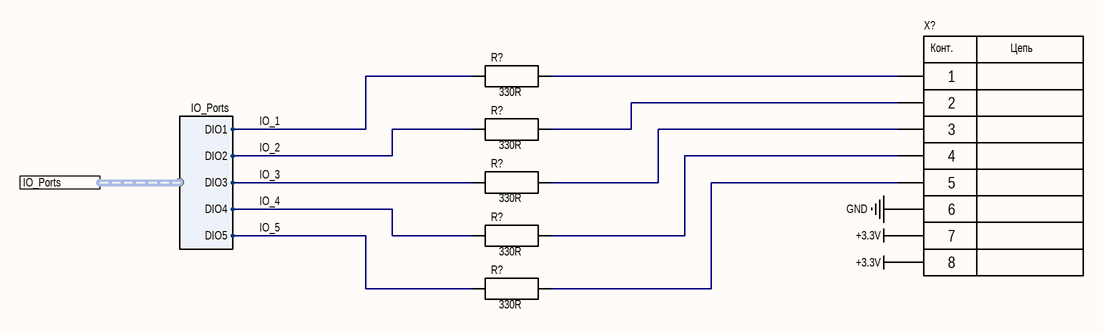
[diagram p6: Схема блока IO_Ports.SchDoc]

### Parts
(Parts that share a designator on the sheet are numbered #1, #2 ... from top to bottom, then left to right.)
R?#25  330R  [CH0603R]
R?#26  330R  [CH0603R]
R?#27  330R  [CH0603R]
R?#28  330R  [CH0603R]
R?#29  330R  [CH0603R]
X?#4  *  [CON: PLD-8]  (value not drawn)

### Ports
IO_Ports (harness IO_Ports)

### Harnesses
IO_Ports: DIO1, DIO2, DIO3, DIO4, DIO5

### Nets
+3.3V: X?#4.7 X?#4.8
GND: X?#4.6
IO_1: R?#25.1 ; port IO_Ports.DIO1
IO_2: R?#26.1 ; port IO_Ports.DIO2
IO_3: R?#27.1 ; port IO_Ports.DIO3
IO_4: R?#28.1 ; port IO_Ports.DIO4
IO_5: R?#29.1 ; port IO_Ports.DIO5
NetR?#25_2: R?#25.2 X?#4.1
NetR?#26_2: R?#26.2 X?#4.2
NetR?#27_2: R?#27.2 X?#4.3
NetR?#28_2: R?#28.2 X?#4.4
NetR?#29_2: R?#29.2 X?#4.5

### Notes on the sheet
- Подп. и дата
- Инв. № дубл.
- Взам. инв. №
- Инв. № подл.
- Изм.
- Лист
- № докум.
- Подп.
- Дата
- 2.106-A3
- Копировал
- Формат А3
- (in symbol 8-Connector) Конт.; Цепь

### Library data of the parts
R?#25-R?#29 = Resistor: Manufacturer: Panasonic Electronic Components; Model: ERJ-3EKF3300V; HelpURL: https://www.digikey.com/en/products/detail/panasonic-electronic-components/ERJ-3EKF3300V/1746374?s=N4IgTCBcDaIKICUBSBmOBpAYilAGXAaiALoC%2BQA; ComponentKind: 0603 (1608 Metric); Value: 330R
X?#4 = 8-Connector: Model: *; Manufacturer: *; HelpURL: *; ComponentKind: *

## Sheet Схема блока SD.SchDoc
size 420 x 297 mm; Address1: Address1; Address2: Address2; Address3: Address3; Address4: Address4; DocumentNumber: АБВГ.123456.001 Э3; SheetNumber: 1; Scale: 1:1; DocumentType: Схема электрическая принципиальная; FirstReferrence: АБВГ.123456.001
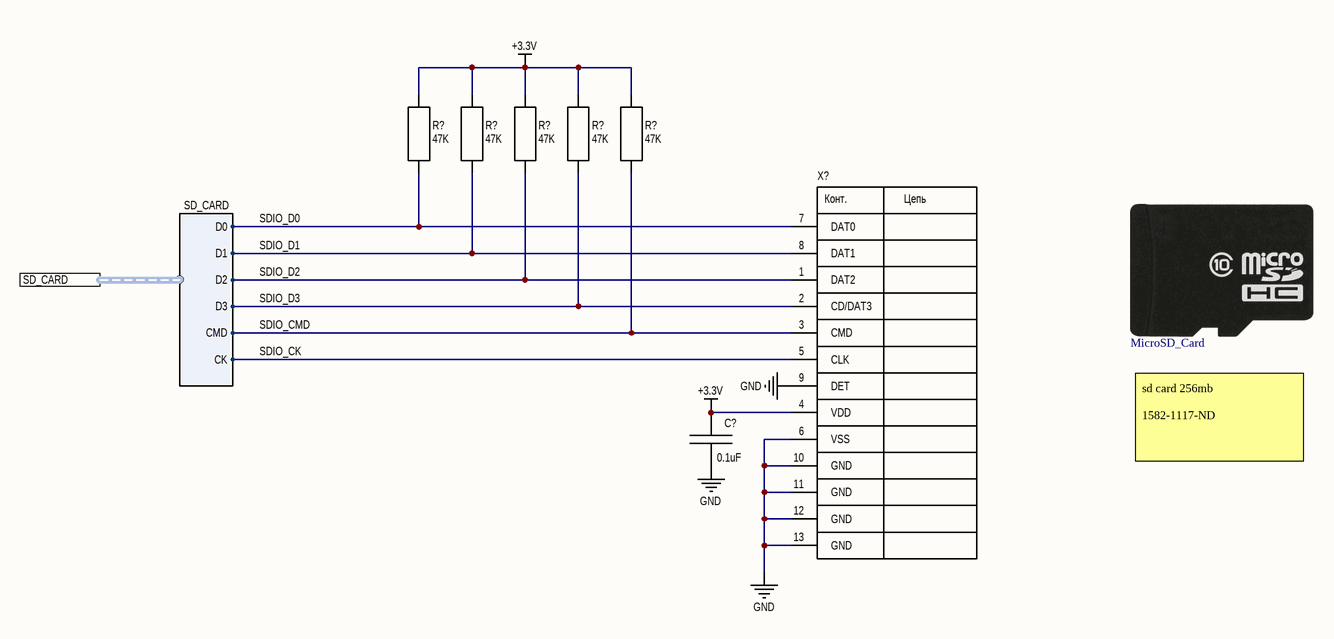
[diagram p7: Схема блока SD.SchDoc]

### Parts
(Parts that share a designator on the sheet are numbered #1, #2 ... from top to bottom, then left to right.)
*?  MicroSD_Card  (mechanical)
C?#32  0.1uF  [CH0603C]
R?#30  47K  [CH0603R]
R?#31  47K  [CH0603R]
R?#32  47K  [CH0603R]
R?#33  47K  [CH0603R]
R?#34  47K  [CH0603R]
X?#5  *  [CON: microSD]  (value not drawn)

### Ports
SD_CARD (harness SD_CARD)

### Harnesses
SD_CARD: D3, D0, D1, D2, CMD, CK

### Nets
+3.3V: C?#32.1 R?#30.2 R?#31.2 R?#32.2 R?#33.2 R?#34.2 X?#5.4(VDD)
GND: C?#32.2 X?#5.6(VSS) X?#5.9(DET) X?#5.10(GND) X?#5.11(GND) X?#5.12(GND) X?#5.13(GND)
SDIO_CK: X?#5.5(CLK) ; port SD_CARD.CK
SDIO_CMD: R?#34.1 X?#5.3(CMD) ; port SD_CARD.CMD
SDIO_D0: R?#30.1 X?#5.7(DAT0) ; port SD_CARD.D0
SDIO_D1: R?#31.1 X?#5.8(DAT1) ; port SD_CARD.D1
SDIO_D2: R?#32.1 X?#5.1(DAT2) ; port SD_CARD.D2
SDIO_D3: R?#33.1 X?#5.2(CD/DAT3) ; port SD_CARD.D3

### Notes on the sheet
- sd card 256mb
  1582-1117-ND
- Подп. и дата
- Инв. № дубл.
- Взам. инв. №
- Инв. № подл.
- Изм.
- Лист
- № докум.
- Подп.
- Дата
- 2.106-A3
- Копировал
- Формат А3
- (in symbol Connector MicroSD) Конт.; Цепь

### Library data of the parts
*? = MicroSD_Card: Manufacturer: Apacer; Manufacturer Part Number: AP-MSD256ISI-1T; Supplier 1: Digi-Key; Supplier Part Number 1: 1582-1117-ND; Stock 1: 4143; Pricing 1: 1=12.85, 10=11.903, 25=11.6336, 50=11.5698, 100=10.1856, 250=9.68168, 500=9.5823, 1000=9.26289 (USD); ComponentLink1URL: http://www.mouser.com/ds/2/24/EDM_mSD(SLC)-957981.pdf; ComponentLink1Description: http://www.mouser.com/ds/2/24/EDM_mSD(SLC)-957981.pdf; ComponentLink2URL: http://eflash.apacerus.com/spec/Card/microSD/Consumer/EDM_mSD(SLC).pdf; ComponentLink2Description: http://eflash.apacerus.com/spec/Card/microSD/Consumer/EDM_mSD(SLC).pdf
C?#32 = Capacitor: Manufacturer: KEMET; Model: C0603C104K5RAC7867; HelpURL: https://www.digikey.com/en/products/detail/kemet/C0603C104K5RAC7867/1465594?s=N4IgTCBcDaIMIAYBsCDMcCMCAsBpArAEoCCcAKgKogC6AvkA; ComponentKind: 0603 (1608 Metric); Value: 0.1uF
R?#30-R?#34 = Resistor: Manufacturer: Panasonic Electronic Components; Model: ERJ-3EKF4702V; HelpURL: https://www.digikey.com/en/products/detail/panasonic-electronic-components/ERJ-3EKF4702V/1746421?s=N4IgTCBcDaIKICUBSBaAzHA0gMQCwHYAGMANRAF0BfIA; ComponentKind: 0603 (1608 Metric); Value: 47K
X?#5 = Connector MicroSD: MicroSD; Model: *; Manufacturer: *; HelpURL: *; ComponentKind: *

## Sheet Схема блока LoRa_RAK3172.SchDoc
size 420 x 297 mm; Address1: Address1; Address2: Address2; Address3: Address3; Address4: Address4; DocumentNumber: АБВГ.123456.001 Э3; SheetNumber: 1; Scale: 1:1; DocumentType: Схема электрическая принципиальная; FirstReferrence: АБВГ.123456.001
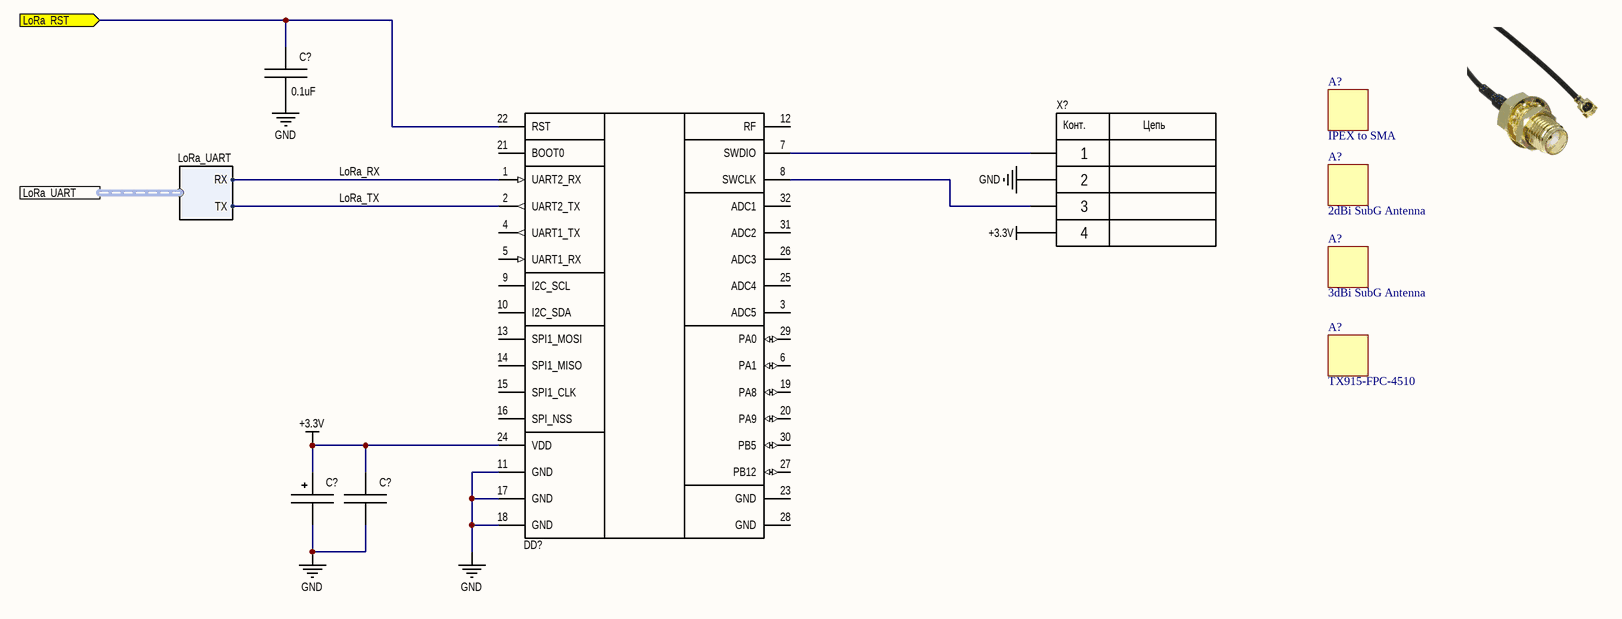
[diagram p8: Схема блока LoRa_RAK3172.SchDoc]

### Parts
(Parts that share a designator on the sheet are numbered #1, #2 ... from top to bottom, then left to right.)
A?#1  IPEX to SMA  (mechanical)
A?#2  2dBi SubG Antenna  (mechanical)
A?#3  3dBi SubG Antenna  (mechanical)
A?#4  TX915-FPC-4510  (mechanical)
C?#33  0.1uF  [CH0603C]
C?#34  *  [TANTAL_A]  (value not drawn)
C?#35  *  [CH0603C]  (value not drawn)
DD?#6  RAK3172  [MOD: RAK3172]  (value not drawn)
X?#6  61300411121  [CON: PLS-4]  (value not drawn)

### Ports
LoRa_RST (in), LoRa_UART (harness LoRa_UART)

### Harnesses
LoRa_UART: RX, TX

### Nets
+3.3V: C?#34.1 C?#35.1 DD?#6.24(VDD) X?#6.4
GND: C?#33.2 C?#34.2 C?#35.2 DD?#6.11(GND) DD?#6.17(GND) DD?#6.18(GND) X?#6.2
LoRa_RX: DD?#6.1(UART2_RX) ; port LoRa_UART.RX
LoRa_TX: DD?#6.2(UART2_TX) ; port LoRa_UART.TX
NetC?#33_1: C?#33.1 DD?#6.22(RST) ; port LoRa_RST
NetDD?#6_7: DD?#6.7(SWDIO) X?#6.1
NetDD?#6_8: DD?#6.8(SWCLK) X?#6.3

Not connected (* = marked no-connect by the designer): DD?#6 3(ADC5) 4(UART1_TX) 5(UART1_RX) 6(PA1) 9(I2C_SCL) 10(I2C_SDA) 12(RF) 13(SPI1_MOSI) 14(SPI1_MISO) 15(SPI1_CLK) 16(SPI_NSS) 19(PA8) 20(PA9) 21(BOOT0) 23(GND) 25(ADC4) 26(ADC3) 27(PB12) 28(GND) 29(PA0) 30(PB5) 31(ADC2) 32(ADC1)

### Notes on the sheet
- Подп. и дата
- Инв. № дубл.
- Взам. инв. №
- Инв. № подл.
- Изм.
- Лист
- № докум.
- Подп.
- Дата
- 2.106-A3
- Копировал
- Формат А3
- (in symbol 4-Connector) Конт.; Цепь

### Library data of the parts
A?#1 = Mechanical_component: IPEX to SMA adapter cable; Manufacturer 1: Adam Equipment; Manufacturer Part Number 1: CA-DKCA0-305L0-AJI0-O; Supplier 1: Digi-Key; Supplier Part Number 1: 2057-CA-DKCA0-305L0-AJI0-O-ND; RoHS: No
A?#2 = Mechanical_component: Manufacturer 1: 5; Manufacturer Part Number 1: 2dBi SubG Antenna; Supplier Unit Price 1: *
A?#3 = Mechanical_component: Manufacturer 1: RAK; Manufacturer Part Number 1: 3dBi SubG Antenna; Supplier Unit Price 1: 7
A?#4 = Mechanical_component: TX915-FPC-4510 868~930MHz adhesive antenna; Manufacturer 1: EBYTE; Manufacturer Part Number 1: TX915-FPC-4510; Supplier Unit Price 1: 0,28
C?#33 = Capacitor: Manufacturer: Samsung Electro-Mechanics; Model: CL10B104KB8NNNC; HelpURL: https://www.digikey.com/en/products/detail/samsung-electro-mechanics/CL10B104KB8NNNC/3886658?s=N4IgTCBcDaIMIBkCMAGAQqgLAaTQDgDki4QBdAXyA; ComponentKind: 0603 (1608 Metric); Value: 0.1uF
C?#34 = TantalCap: Manufacturer: *; Model: *; HelpURL: *; ComponentKind: *; Value: *
C?#35 = Capacitor: Manufacturer: *; Model: *; HelpURL: *; ComponentKind: *; Value: *
DD?#6 = RAK3172: LPWAN Module; Manufacturer: RAK; Model: RAK3172; ComponentKind: SMD; HelpURL: https://docs.rakwireless.com/Product-Categories/WisDuo/RAK3172-Module/Overview/#product-description
X?#6 = 4-Connector: Manufacturer: Würth Elektronik; Model: 61300411121; HelpURL: https://www.digikey.com/en/products/detail/w%C3%BCrth-elektronik/61300411121/4846827?s=N4IgTCBcDaIGwEYDMAGFAWBWwJAXQF8g; ComponentKind: Through Hole 4 position

## Sheet Схема блока MOSFET.SchDoc
size 420 x 297 mm; Address1: Address1; Address2: Address2; Address3: Address3; Address4: Address4; DocumentNumber: АБВГ.123456.001 Э3; SheetNumber: 1; Scale: 1:1; DocumentType: Схема электрическая принципиальная; FirstReferrence: АБВГ.123456.001
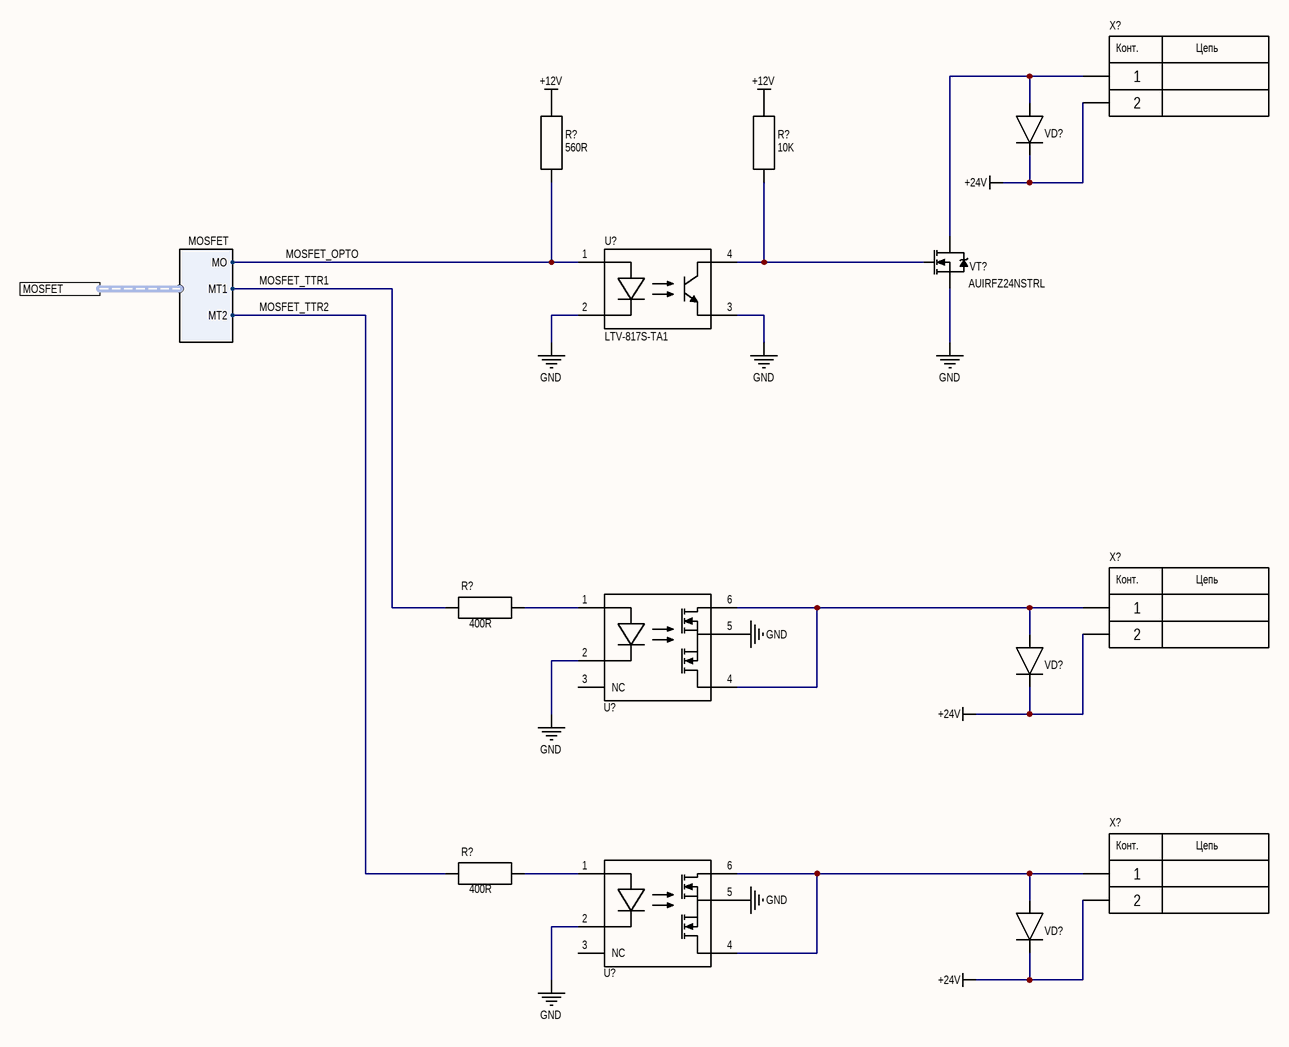
[diagram p9: Схема блока MOSFET.SchDoc]

### Parts
(Parts that share a designator on the sheet are numbered #1, #2 ... from top to bottom, then left to right.)
R?#35  560R  [CH0603R]
R?#36  10K  [CH0603R]
R?#37  400R  [CH0603R]
R?#38  400R  [CH0603R]
U?#1  LTV-817S-TA1  [4-SMD]
U?#2  LCA715S  [6-SMD]  (value not drawn)
U?#3  LCA715S  [6-SMD]  (value not drawn)
VD?#3  *  [DO35]  (value not drawn)
VD?#4  *  [DO35]  (value not drawn)
VD?#5  *  [DO35]  (value not drawn)
VT?#4  AUIRFZ24NSTRL  [DPAK]
X?#7  *  [CON: 300-02P-5.08]  (value not drawn)
X?#8  *  [CON: 300-02P-5.08]  (value not drawn)
X?#9  *  [CON: 300-02P-5.08]  (value not drawn)

### Ports
MOSFET (harness MOSFET)

### Harnesses
MOSFET: MT1, MT2, MO

### Nets
+12V: R?#35.2 R?#36.2
+24V: VD?#3.2 VD?#4.2 VD?#5.2 X?#7.2 X?#8.2 X?#9.2
GND: U?#1.2(C) U?#1.3(E) U?#2.2(C) U?#2.5(-L) U?#3.2(C) U?#3.5(-L) VT?#4.3(S)
MOSFET_OPTO: R?#35.1 U?#1.1(A) ; port MOSFET.MO
MOSFET_TTR1: R?#37.2 ; port MOSFET.MT1
MOSFET_TTR2: R?#38.2 ; port MOSFET.MT2
NetR?#36_1: R?#36.1 U?#1.4(C) VT?#4.1(G)
NetR?#37_1: R?#37.1 U?#2.1(A)
NetR?#38_1: R?#38.1 U?#3.1(A)
NetU?#2_4: U?#2.4(L) U?#2.6(+L) VD?#4.1 X?#8.1
NetU?#3_4: U?#3.4(L) U?#3.6(+L) VD?#5.1 X?#9.1
NetVD?#3_1: VD?#3.1 VT?#4.2(D) X?#7.1

Not connected (* = marked no-connect by the designer): U?#2 3(NC); U?#3 3(NC)

### Notes on the sheet
- Подп. и дата
- Инв. № дубл.
- Взам. инв. №
- Инв. № подл.
- Изм.
- Лист
- № докум.
- Подп.
- Дата
- 2.106-A3
- Копировал
- Формат А3
- (in symbol 2-Connector) Конт.; Цепь

### Library data of the parts
R?#35-R?#38 = Resistor
  R?#35: ComponentKind: 0603 (1608 Metric); Value: 560R
  R?#36: ComponentKind: 0603 (1608 Metric); Value: 10K
  R?#37 R?#38: Manufacturer: *; Model: *; HelpURL: *; ComponentKind: *; Value: 400R
U?#1 = Optoisol: Manufacturer: Lite-On Inc.; Model: LTV-817S-TA1; HelpURL: https://www.digikey.com/en/products/detail/lite-on-inc/LTV-817S-TA1/388451; ComponentKind: 4-SMD
U?#2 U?#3 = LCA715S: Solid State Relay; Manufacturer: IXYS Integrated Circuits Division; Model: LCA715S; HelpURL: https://www.digikey.com/en/products/detail/ixys-integrated-circuits-division/LCA715S/1973063; ComponentKind: 6-SMD
VD?#3-VD?#5 = Diod: ComponentKind: *; Manufacturer: *; Model: *; HelpURL: *
VT?#4 = N-chanel: Mosfet; Manufacturer: Infineon Technologies; Model: AUIRFZ24NSTRL; ComponentKind: D-PAK (TO-252AA); HelpURL: https://www.digikey.com/en/products/detail/infineon-technologies/AUIRFZ24NSTRL/3454970
X?#7-X?#9 = 2-Connector: Model: *; Manufacturer: *; HelpURL: *; ComponentKind: *

## Nets that join several sheets
+3.3V: Схема блока МК (L?.2), Схема блока GSM (HL?#4.1), Схема блока WiFi (C?#30.1 C?#31.1 DD?#5.3), Схема блока USB-UART (R?#19.2), Схема блока Sensors (R?#24.2), Схема блока IO_Ports (X?#4.7 X?#4.8), Схема блока SD (7 pins), Схема блока LoRa_RAK3172 (C?#34.1 C?#35.1 DD?#6.24 X?#6.4)
GND: Схема блока МК (31 pins), Схема блока GSM (31 pins), Схема блока WiFi (36 pins), Схема блока USB-UART (R?#21.1 X?#3.4 X?#3.5), Схема блока Sensors (D?.1), Схема блока IO_Ports (X?#4.6), Схема блока SD (7 pins), Схема блока LoRa_RAK3172 (7 pins), Схема блока MOSFET (7 pins)
1 Wire_TMP: Схема блока МК (DD?#1.91), Схема блока Sensors (D?.2 R?#24.1)
GSM_ON_STATUS: Схема блока МК (DD?#1.36), Схема блока GSM (DD?#3.42)
GSM_PWRKEY: Схема блока МК (DD?#1.35), Схема блока GSM (R?#16.1)
GSM_RX: Схема блока МК (DD?#1.23), Схема блока GSM (DD?#3.2)
GSM_TX: Схема блока МК (DD?#1.24), Схема блока GSM (DD?#3.1)
IO_1: Схема блока МК (DD?#1.51), Схема блока IO_Ports (R?#25.1)
IO_2: Схема блока МК (DD?#1.52), Схема блока IO_Ports (R?#26.1)
IO_3: Схема блока МК (DD?#1.53), Схема блока IO_Ports (R?#27.1)
IO_4: Схема блока МК (DD?#1.54), Схема блока IO_Ports (R?#28.1)
LoRa_RX: Схема блока МК (DD?#1.69), Схема блока LoRa_RAK3172 (DD?#6.1)
LoRa_TX: Схема блока МК (DD?#1.68), Схема блока LoRa_RAK3172 (DD?#6.2)
MOSFET_OPTO: Схема блока МК (DD?#1.85), Схема блока MOSFET (R?#35.1 U?#1.1)
MOSFET_TTR1: Схема блока МК (DD?#1.86), Схема блока MOSFET (R?#37.2)
MOSFET_TTR2: Схема блока МК (DD?#1.87), Схема блока MOSFET (R?#38.2)
SDIO_CK: Схема блока МК (DD?#1.80), Схема блока SD (X?#5.5)
SDIO_CMD: Схема блока МК (DD?#1.83), Схема блока SD (R?#34.1 X?#5.3)
SDIO_D0: Схема блока МК (DD?#1.65), Схема блока SD (R?#30.1 X?#5.7)
SDIO_D1: Схема блока МК (DD?#1.66), Схема блока SD (R?#31.1 X?#5.8)
SDIO_D2: Схема блока МК (DD?#1.78), Схема блока SD (R?#32.1 X?#5.1)
SDIO_D3: Схема блока МК (DD?#1.79), Схема блока SD (R?#33.1 X?#5.2)
USB_BOOT: Схема блока МК (DD?#1.67), Схема блока USB-UART (R?#20.1)
USB_D+: Схема блока МК (DD?#1.71), Схема блока USB-UART (R?#23.1 VT?#3.3)
USB_D-: Схема блока МК (DD?#1.70), Схема блока USB-UART (R?#22.1)
WiFi_EN: Схема блока МК (DD?#1.16), Схема блока WiFi (DD?#4.45)
WiFi_RX: Схема блока МК (DD?#1.48), Схема блока WiFi (DD?#4.40)
WiFi_TX: Схема блока МК (DD?#1.47), Схема блока WiFi (DD?#4.39)